# EAGLE design flex10k_board (EAGLE 8.2.2)
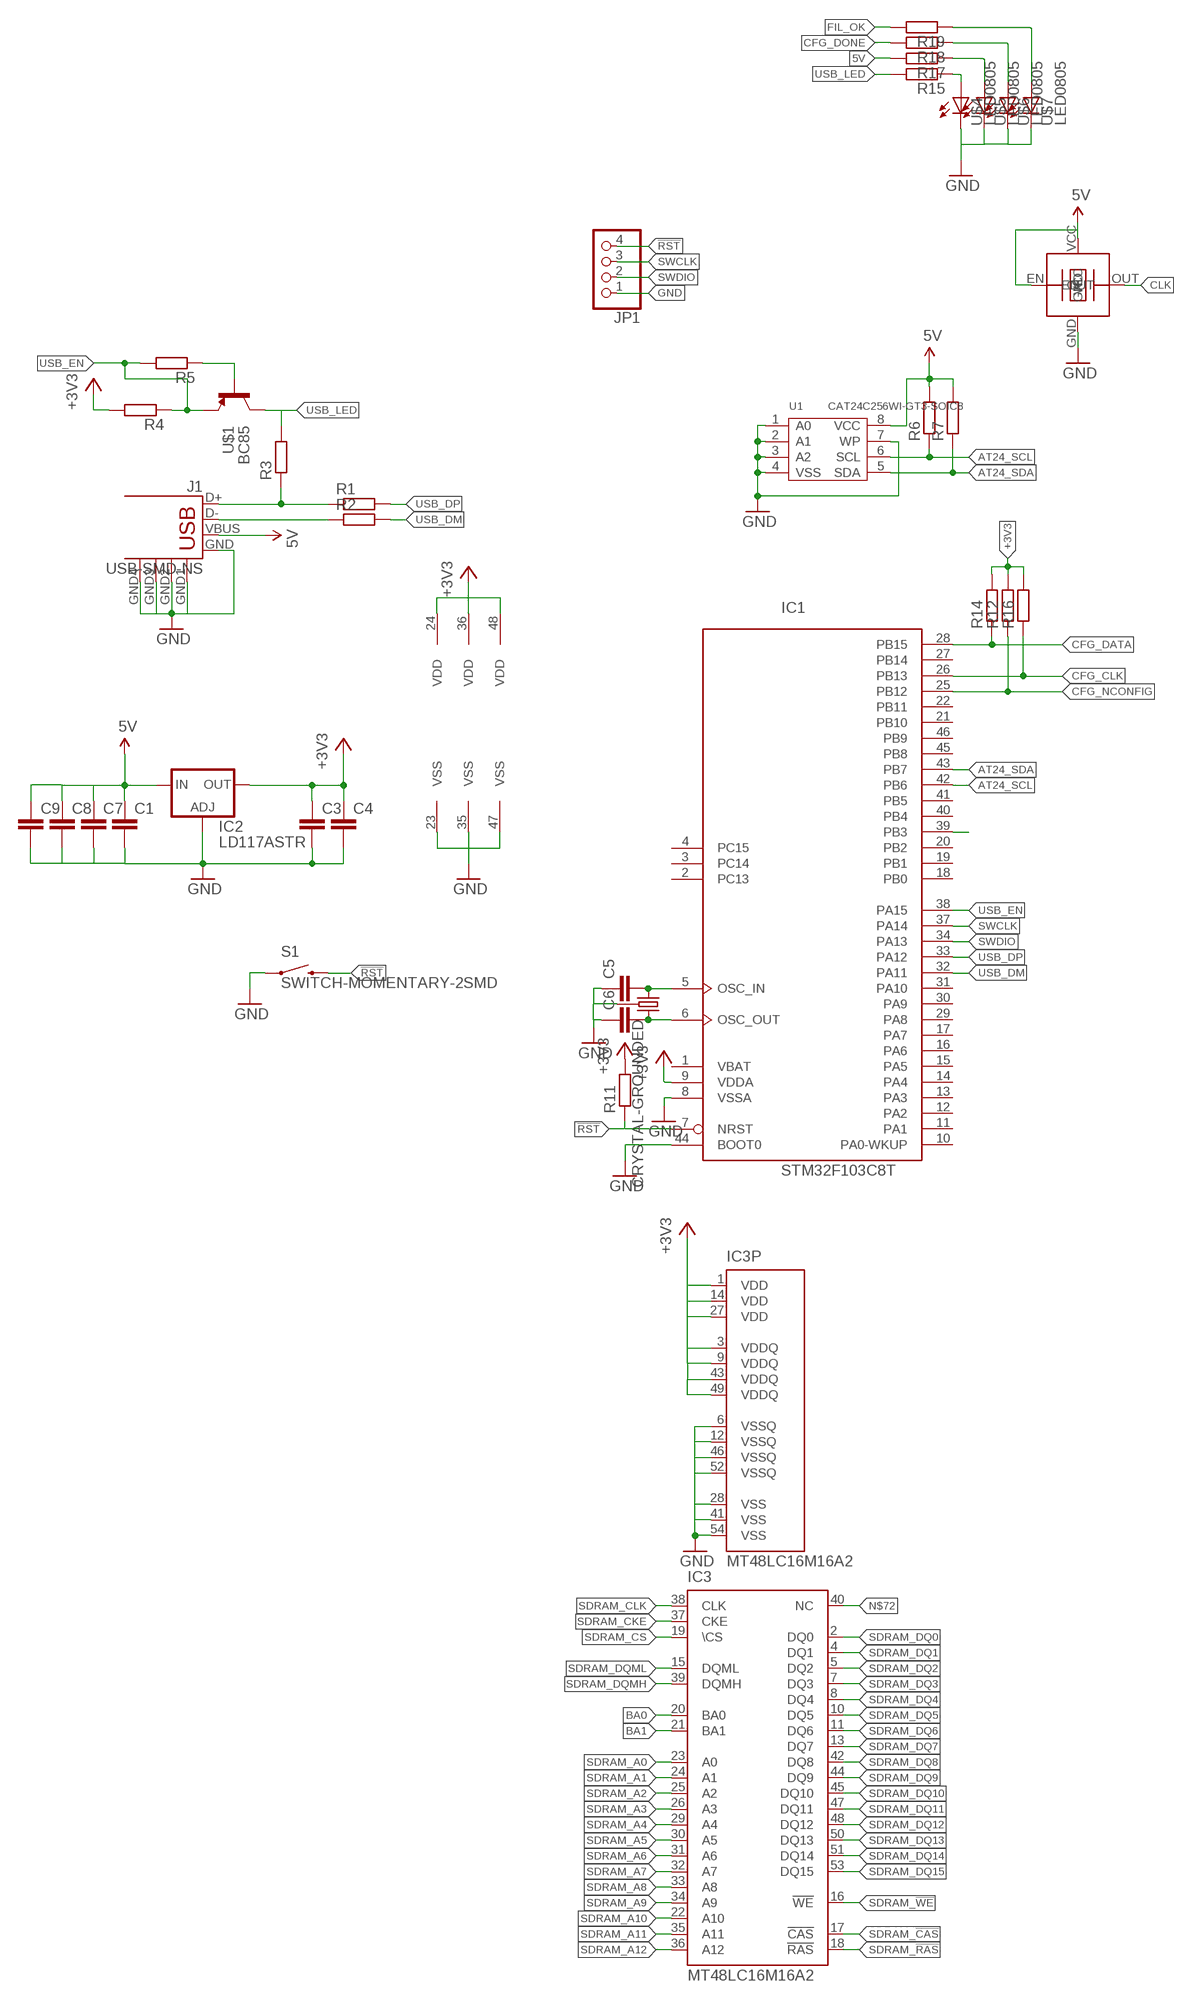
[diagram p0: schematic, sheet 1, part 1 of 3]
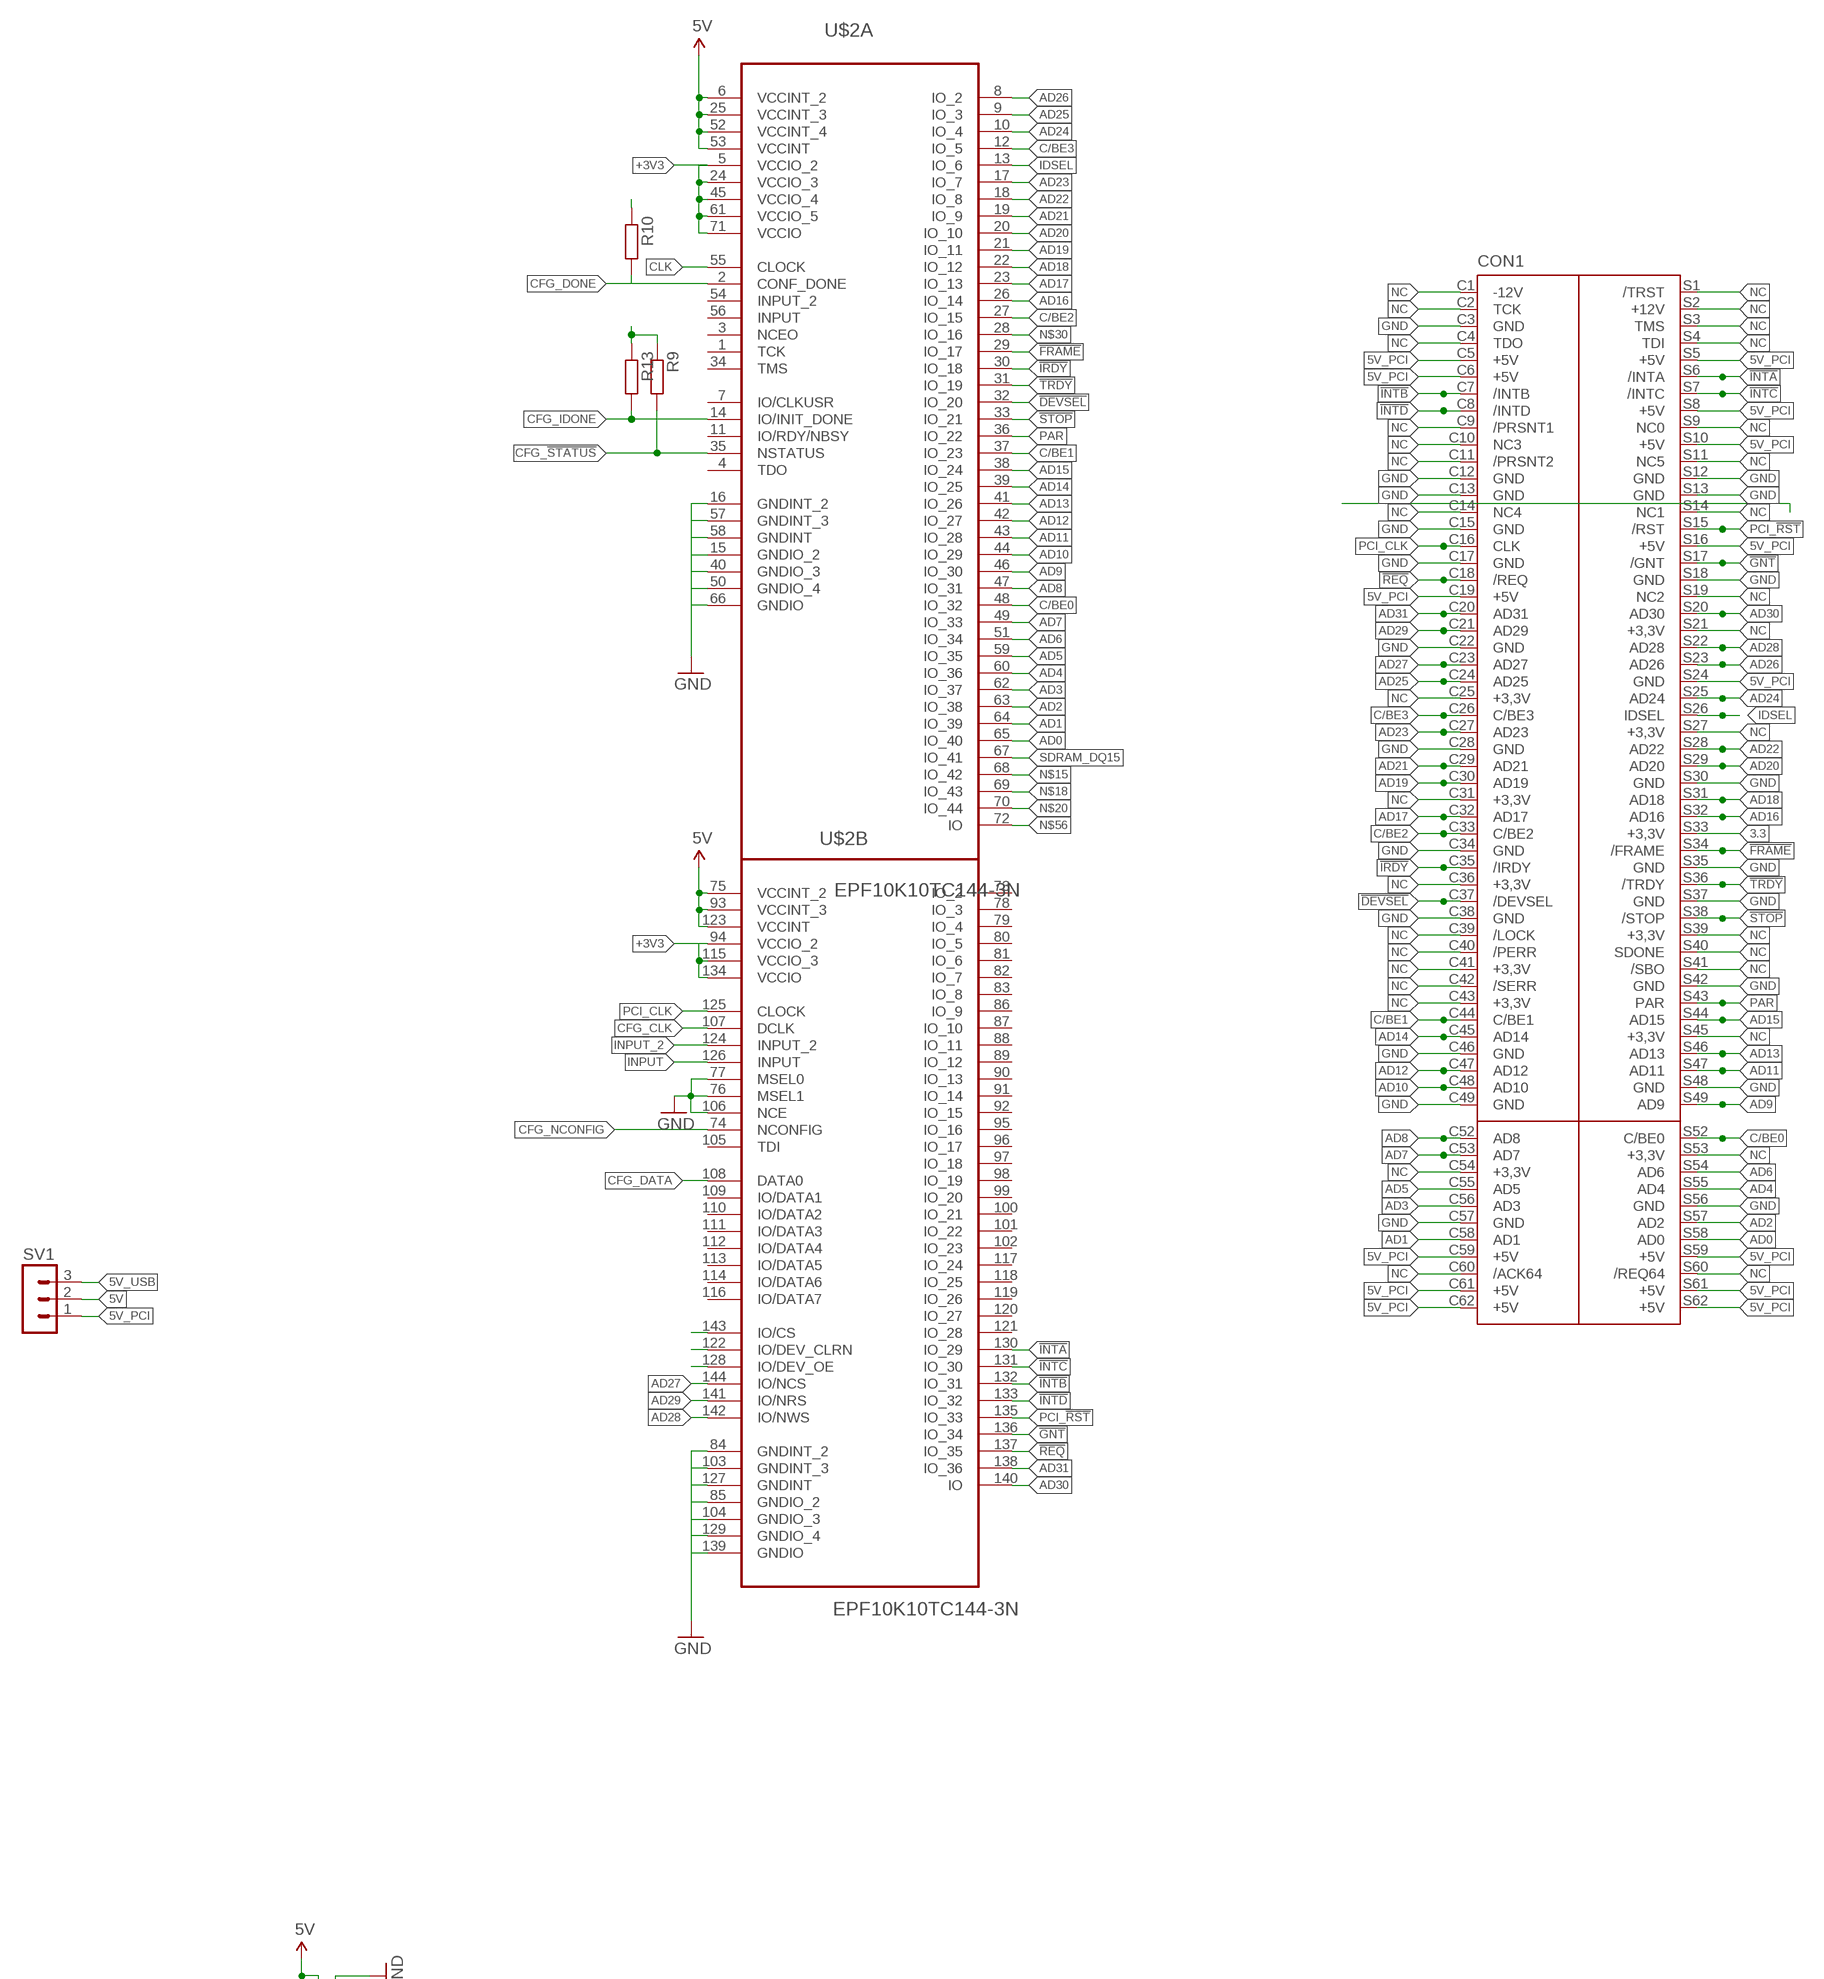
[diagram p1: schematic, sheet 1, part 2 of 3]
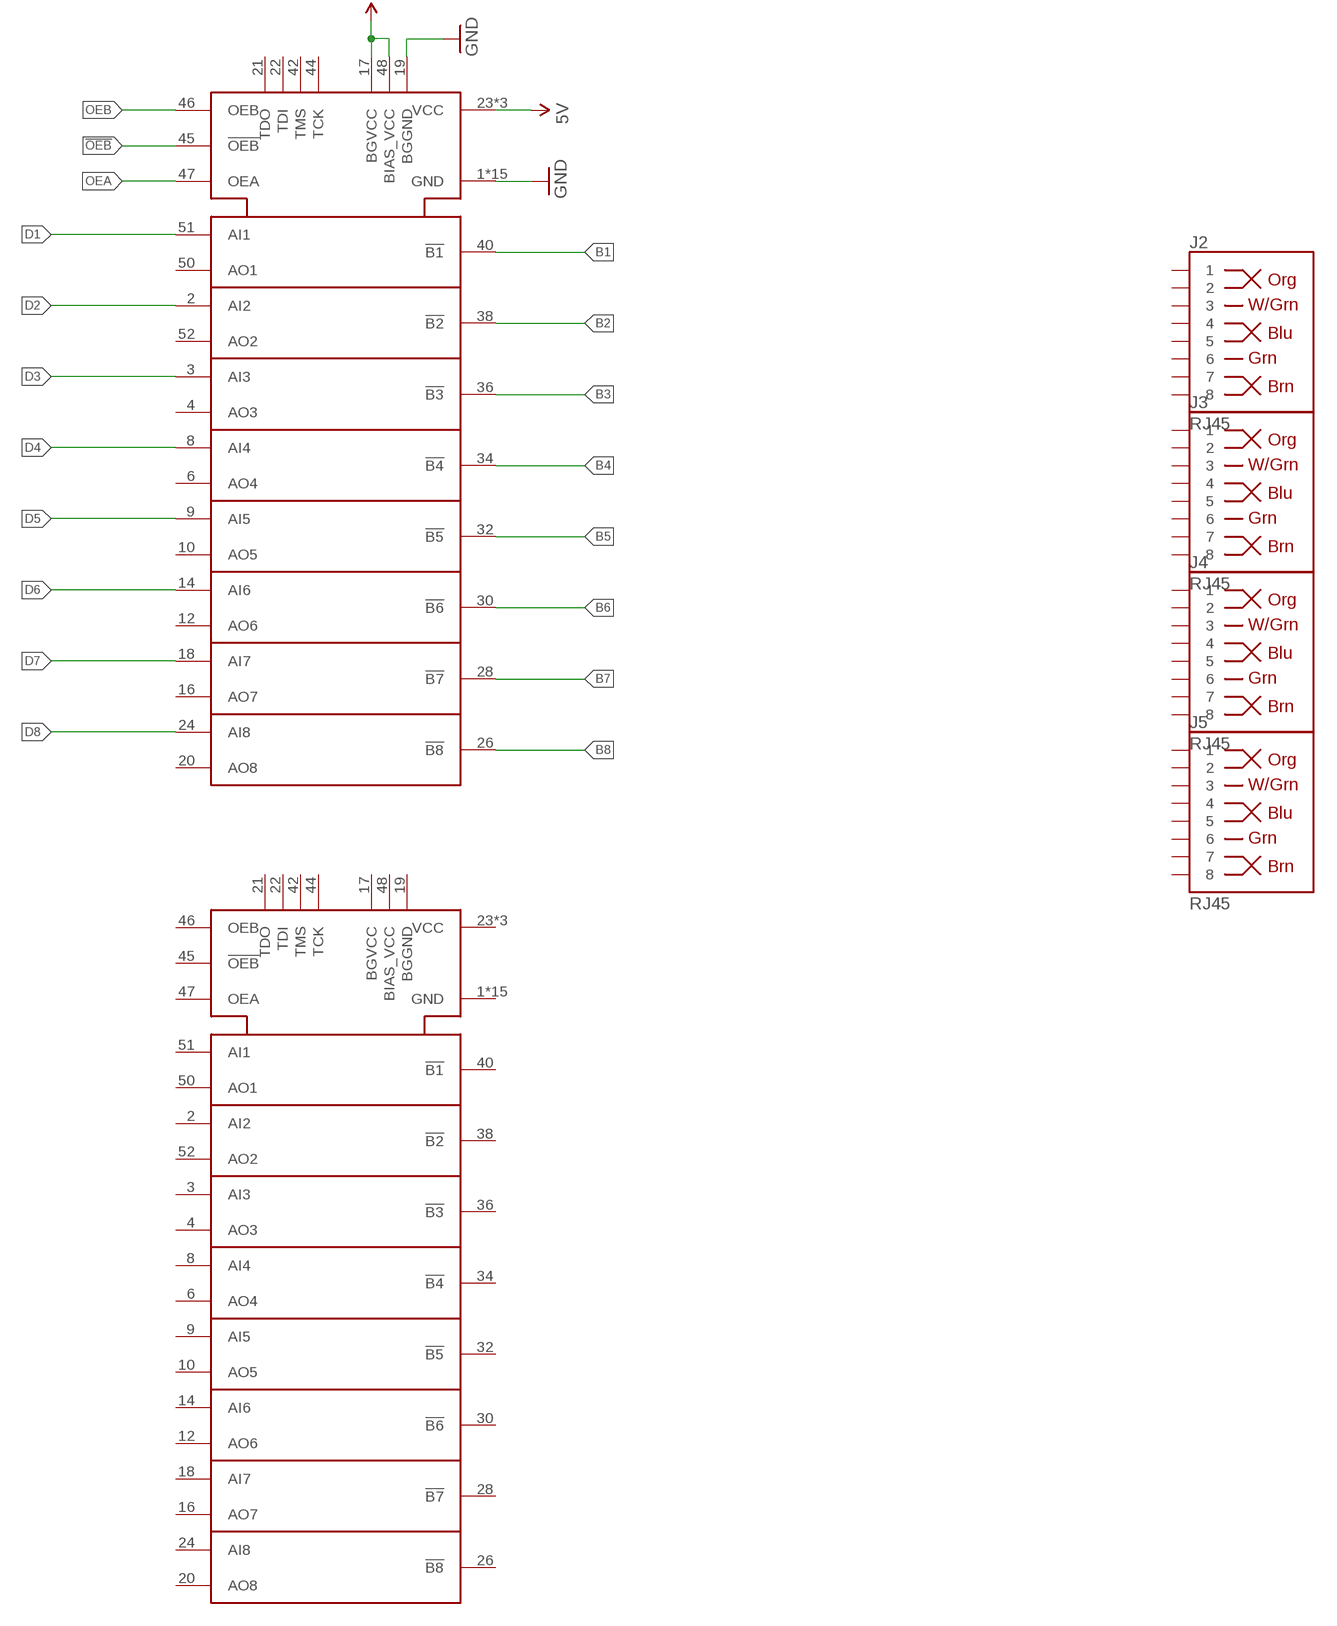
[diagram p2: schematic, sheet 1, part 3 of 3]

## Parts
C1  CC0805  [C0805]
C3  CC0805  [C0805]
C4  CC0805  [C0805]
C5  CC0603  [C0603]
C6  CC0603  [C0603]
C7  CC0805  [C0805]
C8  CC0805  [C0805]
C9  CC0805  [C0805]
CON1  PCI_CON  [PCI_BRDL]
IC1  STM32F103C8T  [LQFP48]
IC2  LD117ASTR  [SOT223]
IC3  MT48LC16M16A2  [TSOP54-400]
J1  USB-SMD-NS  [USB-MINIB-NOSTOP]
J2  RJ45  RJ45-8PTH  [RJ45-8]
J3  RJ45  RJ45-8PTH  [RJ45-8]
J4  RJ45  RJ45-8PTH  [RJ45-8]
J5  RJ45  RJ45-8PTH  [RJ45-8]
JP1  PINHD-1X4  [1X04]
R1  R0603  [0603]
R2  R0603  [0603]
R3  R0603  [0603]
R4  R0603  [0603]
R5  R0603  [0603]
R6  R0603  [0603]
R7  R0603  [0603]
R9  R0603  [0603]
R10  R0603  [0603]
R11  R0603  [0603]
R12  R0603  [0603]
R13  R0603  [0603]
R14  R0603  [0603]
R15  R0603  [0603]
R16  R0603  [0603]
R17  R0603  [0603]
R18  R0603  [0603]
R19  R0603  [0603]
S1  SWITCH-MOMENTARY-2SMD  [TACTILE-SWITCH-SMD]
SV1  MA03-1  [MA03-1]
U1  CAT24C256WI-GT3-SOIC8  EEPROM-CAT24C256WI-GT3(SOIC8)  [SOIC8-1.27-5X4MM]
U$1  BC85  [SOT23]
U$2  EPF10K10TC144-3N  [QFP50P2200X2200X160-144N]
U$3  TXC-BA  [7X5]
U$4  LED0805  [0805-LED]
U$5  LED0805  [0805-LED]
U$6  LED0805  [0805-LED]
U$7  LED0805  [0805-LED]
U$8  CRYSTAL-GROUNDED  [CRYSTAL-SMD-5X3]
U$9  SN74FB2050  [TQFP-10X10-52]
U$10  SN74FB2050  [TQFP-10X10-52]

## Nets
3.3: CON1.S33(+3,3V)
5V: C1.1 C7.1 C8.1 C9.1 IC2.3(IN) R6.2 R7.2 R17.2 SV1.2 U1.8(VCC) U$2.6(A:VCCINT_2) U$2.25(A:VCCINT_3) U$2.52(A:VCCINT_4) U$2.53(A:VCCINT) U$2.75(B:VCCINT_2) U$2.93(B:VCCINT_3) U$2.123(B:VCCINT) U$3.EN U$3.VCC U$10.17(BGVCC) U$10.23(VCC) U$10.43(VCC) U$10.48(BIAS_VCC) U$10.49(VCC)
5V_PCI: CON1.C5(+5V) CON1.C6(+5V) CON1.C19(+5V) CON1.C59(+5V) CON1.C61(+5V) CON1.C62(+5V) CON1.S5(+5V) CON1.S8(+5V) CON1.S10(+5V) CON1.S16(+5V) CON1.S24(GND) CON1.S59(+5V) CON1.S61(+5V) CON1.S62(+5V) SV1.1
5V_USB: J1.VBUS SV1.3 ; supply symbol labelled 5V
!DEVSEL: CON1.C37(/DEVSEL) U$2.32(A:IO_20)
!FRAME: CON1.S34(/FRAME) U$2.29(A:IO_17)
!GNT: CON1.S17(/GNT) U$2.136(B:IO_34)
!INTA: CON1.S6(/INTA) U$2.130(B:IO_29)
!INTB: CON1.C7(/INTB) U$2.132(B:IO_31)
!INTC: CON1.S7(/INTC) U$2.131(B:IO_30)
!INTD: CON1.C8(/INTD) U$2.133(B:IO_32)
!IRDY: CON1.C35(/IRDY) U$2.30(A:IO_18)
!OEB: U$10.45(!OEB)
!REQ: CON1.C18(/REQ) U$2.137(B:IO_35)
!RST: IC1.7(NRST) JP1.4 R11.1 S1.3
!STOP: CON1.S38(/STOP) U$2.33(A:IO_21)
!TRDY: CON1.S36(/TRDY) U$2.31(A:IO_19)
+3V3: C3.1 C4.1 IC1.9(VDDA) IC1.24(VDD) IC1.36(VDD) IC1.48(VDD) IC2.4(OUT) IC3.1(VDD) IC3.3(VDDQ) IC3.9(VDDQ) IC3.14(VDD) IC3.27(VDD) IC3.43(VDDQ) IC3.49(VDDQ) R4.2 R9.1 R10.1 R11.2 R12.2 R13.1 R14.2 R16.2 U$2.5(A:VCCIO_2) U$2.24(A:VCCIO_3) U$2.45(A:VCCIO_4) U$2.61(A:VCCIO_5) U$2.71(A:VCCIO) U$2.94(B:VCCIO_2) U$2.115(B:VCCIO_3) U$2.134(B:VCCIO)
AD0: CON1.S58(AD0) U$2.65(A:IO_40)
AD1: CON1.C58(AD1) U$2.64(A:IO_39)
AD2: CON1.S57(AD2) U$2.63(A:IO_38)
AD3: CON1.C56(AD3) U$2.62(A:IO_37)
AD4: CON1.S55(AD4) U$2.60(A:IO_36)
AD5: CON1.C55(AD5) U$2.59(A:IO_35)
AD6: CON1.S54(AD6) U$2.51(A:IO_34)
AD7: CON1.C53(AD7) U$2.49(A:IO_33)
AD8: CON1.C52(AD8) U$2.47(A:IO_31)
AD9: CON1.S49(AD9) U$2.46(A:IO_30)
AD10: CON1.C48(AD10) U$2.44(A:IO_29)
AD11: CON1.S47(AD11) U$2.43(A:IO_28)
AD12: CON1.C47(AD12) U$2.42(A:IO_27)
AD13: CON1.S46(AD13) U$2.41(A:IO_26)
AD14: CON1.C45(AD14) U$2.39(A:IO_25)
AD15: CON1.S44(AD15) U$2.38(A:IO_24)
AD16: CON1.S32(AD16) U$2.26(A:IO_14)
AD17: CON1.C32(AD17) U$2.23(A:IO_13)
AD18: CON1.S31(AD18) U$2.22(A:IO_12)
AD19: CON1.C30(AD19) U$2.21(A:IO_11)
AD20: CON1.S29(AD20) U$2.20(A:IO_10)
AD21: CON1.C29(AD21) U$2.19(A:IO_9)
AD22: CON1.S28(AD22) U$2.18(A:IO_8)
AD23: CON1.C27(AD23) U$2.17(A:IO_7)
AD24: CON1.S25(AD24) U$2.10(A:IO_4)
AD25: CON1.C24(AD25) U$2.9(A:IO_3)
AD26: CON1.S23(AD26) U$2.8(A:IO_2)
AD27: CON1.C23(AD27) U$2.144(B:IO/NCS)
AD28: CON1.S22(AD28) U$2.142(B:IO/NWS)
AD29: CON1.C21(AD29) U$2.141(B:IO/NRS)
AD30: CON1.S20(AD30) U$2.140(B:IO)
AD31: CON1.C20(AD31) U$2.138(B:IO_36)
AT24_SCL: IC1.42(PB6) R6.1 U1.6(SCL)
AT24_SDA: IC1.43(PB7) R7.1 U1.5(SDA)
B1: U$10.40(!B1)
B2: U$10.38(!B2)
B3: U$10.36(!B3)
B4: U$10.34(!B4)
B5: U$10.32(!B5)
B6: U$10.30(!B6)
B7: U$10.28(!B7)
B8: U$10.26(!B8)
BA0: IC3.20(BA0)
BA1: IC3.21(BA1)
C/BE0: CON1.S52(C/BE0) U$2.48(A:IO_32)
C/BE1: CON1.C44(C/BE1) U$2.37(A:IO_23)
C/BE2: CON1.C33(C/BE2) U$2.27(A:IO_15)
C/BE3: CON1.C26(C/BE3) U$2.12(A:IO_5)
CFG_!STATUS: R9.2 U$2.35(A:NSTATUS)
CFG_CLK: IC1.26(PB13) R16.1 U$2.107(B:DCLK)
CFG_DATA: IC1.28(PB15) R14.1 U$2.108(B:DATA0)
CFG_DONE: R10.2 R18.2 U$2.2(A:CONF_DONE)
CFG_IDONE: R13.2 U$2.14(A:IO/INIT_DONE)
CFG_NCONFIG: IC1.25(PB12) R12.1 U$2.74(B:NCONFIG)
CLK: U$2.55(A:CLOCK) U$3.OUT
D1: U$10.51(AI1)
D2: U$10.2(AI2)
D3: U$10.3(AI3)
D4: U$10.8(AI4)
D5: U$10.9(AI5)
D6: U$10.14(AI6)
D7: U$10.18(AI7)
D8: U$10.24(AI8)
FIL_OK: IC1.39(PB3) R19.2
GND: C1.2 C3.2 C4.2 C5.1 C6.1 C7.2 C8.2 C9.2 CON1.C3(GND) CON1.C12(GND) CON1.C13(GND) CON1.C15(GND) CON1.C17(GND) CON1.C22(GND) CON1.C28(GND) CON1.C34(GND) CON1.C38(GND) CON1.C46(GND) CON1.C49(GND) CON1.C57(GND) CON1.S12(GND) CON1.S13(GND) CON1.S18(GND) CON1.S30(GND) CON1.S35(GND) CON1.S37(GND) CON1.S42(GND) CON1.S48(GND) CON1.S56(GND) IC1.8(VSSA) IC1.23(VSS) IC1.35(VSS) IC1.44(BOOT0) IC1.47(VSS) IC2.1(ADJ) IC3.6(VSSQ) IC3.12(VSSQ) IC3.28(VSS) IC3.41(VSS) IC3.46(VSSQ) IC3.52(VSSQ) IC3.54(VSS) J1.GND J1.GND1(GND) J1.GND2(GND) J1.GND3(GND) J1.GND4(GND) JP1.1 S1.1 U1.1(A0) U1.2(A1) U1.3(A2) U1.4(VSS) U1.7(WP) U$2.15(A:GNDIO_2) U$2.16(A:GNDINT_2) U$2.40(A:GNDIO_3) U$2.50(A:GNDIO_4) U$2.57(A:GNDINT_3) U$2.58(A:GNDINT) U$2.66(A:GNDIO) U$2.76(B:MSEL1) U$2.77(B:MSEL0) U$2.84(B:GNDINT_2) U$2.85(B:GNDIO_2) U$2.103(B:GNDINT_3) U$2.104(B:GNDIO_3) U$2.106(B:NCE) U$2.127(B:GNDINT) U$2.129(B:GNDIO_4) U$2.139(B:GNDIO) U$3.GND U$4.C U$5.C U$6.C U$7.C U$8.2 U$8.4 U$10.1(GND) U$10.5(GND) U$10.7(GND) U$10.11(GND) U$10.13(GND) U$10.15(GND) U$10.19(BGGND) U$10.25(GND) U$10.27(GND) U$10.29(GND) U$10.31(GND) U$10.33(GND) U$10.35(GND) U$10.37(GND) U$10.39(GND) U$10.41(GND)
IDSEL: CON1.S26(IDSEL) U$2.13(A:IO_6)
INPUT: U$2.126(B:INPUT)
INPUT_2: U$2.124(B:INPUT_2)
N$1: C5.2 IC1.5(OSC_IN) U$8.3
N$2: J1.D- R2.1
N$3: C6.2 IC1.6(OSC_OUT) U$8.1
N$4: J1.D+ R1.1 R3.1
N$5: U$2.128(B:IO/DEV_OE)
N$6: U$2.122(B:IO/DEV_CLRN)
N$7: R5.1 U$1.1(B)
N$9: U$2.143(B:IO/CS)
N$10: R15.1 U$4.A
N$11: R17.1 U$5.A
N$12: R18.1 U$6.A
N$13: R19.1 U$7.A
N$15: U$2.68(A:IO_42)
N$18: U$2.69(A:IO_43)
N$20: U$2.70(A:IO_44)
N$30: U$2.28(A:IO_16)
N$56: U$2.72(A:IO)
N$72: IC3.40(NC)
NC: CON1.C1(-12V) CON1.C2(TCK) CON1.C4(TDO) CON1.C9(/PRSNT1) CON1.C10(NC3) CON1.C11(/PRSNT2) CON1.C14(NC4) CON1.C25(+3,3V) CON1.C31(+3,3V) CON1.C36(+3,3V) CON1.C39(/LOCK) CON1.C40(/PERR) CON1.C41(+3,3V) CON1.C42(/SERR) CON1.C43(+3,3V) CON1.C54(+3,3V) CON1.C60(/ACK64) CON1.S1(/TRST) CON1.S2(+12V) CON1.S3(TMS) CON1.S4(TDI) CON1.S9(NC0) CON1.S11(NC5) CON1.S14(NC1) CON1.S19(NC2) CON1.S21(+3,3V) CON1.S27(+3,3V) CON1.S39(+3,3V) CON1.S40(SDONE) CON1.S41(/SBO) CON1.S45(+3,3V) CON1.S53(+3,3V) CON1.S60(/REQ64)
OEA: U$10.47(OEA)
OEB: U$10.46(OEB)
PAR: CON1.S43(PAR) U$2.36(A:IO_22)
PCI_!RST: CON1.S15(/RST) U$2.135(B:IO_33)
PCI_CLK: CON1.C16(CLK) U$2.125(B:CLOCK)
SDRAM_!CAS: IC3.17(!CAS)
SDRAM_!RAS: IC3.18(!RAS)
SDRAM_!WE: IC3.16(!WE)
SDRAM_A0: IC3.23(A0)
SDRAM_A1: IC3.24(A1)
SDRAM_A2: IC3.25(A2)
SDRAM_A3: IC3.26(A3)
SDRAM_A4: IC3.29(A4)
SDRAM_A5: IC3.30(A5)
SDRAM_A6: IC3.31(A6)
SDRAM_A7: IC3.32(A7)
SDRAM_A8: IC3.33(A8)
SDRAM_A9: IC3.34(A9)
SDRAM_A10: IC3.22(A10)
SDRAM_A11: IC3.35(A11)
SDRAM_A12: IC3.36(A12)
SDRAM_CKE: IC3.37(CKE)
SDRAM_CLK: IC3.38(CLK)
SDRAM_CS: IC3.19(\CS)
SDRAM_DQ0: IC3.2(DQ0)
SDRAM_DQ1: IC3.4(DQ1)
SDRAM_DQ2: IC3.5(DQ2)
SDRAM_DQ3: IC3.7(DQ3)
SDRAM_DQ4: IC3.8(DQ4)
SDRAM_DQ5: IC3.10(DQ5)
SDRAM_DQ6: IC3.11(DQ6)
SDRAM_DQ7: IC3.13(DQ7)
SDRAM_DQ8: IC3.42(DQ8)
SDRAM_DQ9: IC3.44(DQ9)
SDRAM_DQ10: IC3.45(DQ10)
SDRAM_DQ11: IC3.47(DQ11)
SDRAM_DQ12: IC3.48(DQ12)
SDRAM_DQ13: IC3.50(DQ13)
SDRAM_DQ14: IC3.51(DQ14)
SDRAM_DQ15: IC3.53(DQ15) U$2.67(A:IO_41)
SDRAM_DQMH: IC3.39(DQMH)
SDRAM_DQML: IC3.15(DQML)
SWCLK: IC1.37(PA14) JP1.3
SWDIO: IC1.34(PA13) JP1.2
USB_DM: IC1.32(PA11) R2.2
USB_DP: IC1.33(PA12) R1.2
USB_EN: IC1.38(PA15) R4.1 R5.2 U$1.2(E)
USB_LED: R3.2 R15.2 U$1.3(C)
Unconnected: IC1.2(PC13) IC1.3(PC14) IC1.4(PC15) IC1.10(PA0-WKUP) IC1.11(PA1) IC1.12(PA2) IC1.13(PA3) IC1.14(PA4) IC1.15(PA5) IC1.16(PA6) IC1.17(PA7) IC1.18(PB0) IC1.19(PB1) IC1.20(PB2) IC1.21(PB10) IC1.22(PB11) IC1.27(PB14) IC1.29(PA8) IC1.30(PA9) IC1.31(PA10) IC1.40(PB4) IC1.41(PB5) IC1.45(PB8) IC1.46(PB9) J2.1 J2.2 J2.3 J2.4 J2.5 J2.6 J2.7 J2.8 J3.1 J3.2 J3.3 J3.4 J3.5 J3.6 J3.7 J3.8 J4.1 J4.2 J4.3 J4.4 J4.5 J4.6 J4.7 J4.8 J5.1 J5.2 J5.3 J5.4 J5.5 J5.6 J5.7 J5.8 U$2.1(A:TCK) U$2.3(A:NCEO) U$2.4(A:TDO) U$2.7(A:IO/CLKUSR) U$2.11(A:IO/RDY/NBSY) U$2.34(A:TMS) U$2.54(A:INPUT_2) U$2.56(A:INPUT) U$2.73(B:IO_2) U$2.78(B:IO_3) U$2.79(B:IO_4) U$2.80(B:IO_5) U$2.81(B:IO_6) U$2.82(B:IO_7) U$2.83(B:IO_8) U$2.86(B:IO_9) U$2.87(B:IO_10) U$2.88(B:IO_11) U$2.89(B:IO_12) U$2.90(B:IO_13) U$2.91(B:IO_14) U$2.92(B:IO_15) U$2.95(B:IO_16) U$2.96(B:IO_17) U$2.97(B:IO_18) U$2.98(B:IO_19) U$2.99(B:IO_20) U$2.100(B:IO_21) U$2.101(B:IO_22) U$2.102(B:IO_23) U$2.105(B:TDI) U$2.109(B:IO/DATA1) U$2.110(B:IO/DATA2) U$2.111(B:IO/DATA3) U$2.112(B:IO/DATA4) U$2.113(B:IO/DATA5) U$2.114(B:IO/DATA6) U$2.116(B:IO/DATA7) U$2.117(B:IO_24) U$2.118(B:IO_25) U$2.119(B:IO_26) U$2.120(B:IO_27) U$2.121(B:IO_28) U$9.1(GND) U$9.2(AI2) U$9.3(AI3) U$9.4(AO3) U$9.5(GND) U$9.6(AO4) U$9.7(GND) U$9.8(AI4) U$9.9(AI5) U$9.10(AO5) U$9.11(GND) U$9.12(AO6) U$9.13(GND) U$9.14(AI6) U$9.15(GND) U$9.16(AO7) U$9.17(BGVCC) U$9.18(AI7) U$9.19(BGGND) U$9.20(AO8) U$9.21(TDO) U$9.22(TDI) U$9.23(VCC) U$9.24(AI8) U$9.25(GND) U$9.26(!B8) U$9.27(GND) U$9.28(!B7) U$9.29(GND) U$9.30(!B6) U$9.31(GND) U$9.32(!B5) U$9.33(GND) U$9.34(!B4) U$9.35(GND) U$9.36(!B3) U$9.37(GND) U$9.38(!B2) U$9.39(GND) U$9.40(!B1) U$9.41(GND) U$9.42(TMS) U$9.43(VCC) U$9.44(TCK) U$9.45(!OEB) U$9.46(OEB) U$9.47(OEA) U$9.48(BIAS_VCC) U$9.49(VCC) U$9.50(AO1) U$9.51(AI1) U$9.52(AO2) U$10.4(AO3) U$10.6(AO4) U$10.10(AO5) U$10.12(AO6) U$10.16(AO7) U$10.20(AO8) U$10.21(TDO) U$10.22(TDI) U$10.42(TMS) U$10.44(TCK) U$10.50(AO1) U$10.52(AO2)

## Power pins joined to a net without a drawn wire
VBAT: IC1.1(VBAT)

## Library data of the parts
C1 C3-C9 = smalsmd:C: Capacitor
CON1 = con-pc:PCI_CON: PCI BOARD LONG
IC1 = stm32:STM32F103C*T: ARM 32-bit Cortex™-M3 CPU 72 MHz maximum frequency 16 to 128 Kbytes of Flash memory 6 to 20 kbytes of SRAM 37 GPIOs 2.0 to 3.6 V application supply
IC2 = v-reg:LD117A?*: Low drop fixed and adjustable positive voltage regulators 1 A Source: http://www.st.com/stonline/products/literature/ds/7194/ld1117axx.pdf
IC3 = memory-micron:MT48LC16M16A2: 256Mb: x16 SDRAM MT48LC16M16A2 - 4 Meg x 16 x 4 banks Source: http://download.micron.com/pdf/datasheets/dram/sdram/256MSDRAM.pdf; OC_FARNELL: unknown; OC_NEWARK: unknown
J1 = SparkFun-Connectors:USB: USB Connectors USB-B-PTH is fully proven SKU : PRT-00139/CONN-08278 USB-miniB is fully proven SKU : PRT-00587 USB-A-PCB is untested. USB-A-H is throughly reviewed, but untested. Spark Fun Electronics SKU : PRT-00437 USB-B-SMT is throughly reviewed, but untested. Needs silkscreen touching up. USB-A-S has not been used/tested USB-MB-H has not been used/tested USB-MICROB has been used. CONN-09505
J2-J5 = SparkFun-Connectors:RJ45-8: RJ45 Jack Simple RJ45, 8-pin connection - connector for common Cat5, Cat5e, and Cat6 Ethernet cables. Footprint not yet proven in production. Connector sku is PRT-00643; Breakout PCB sku is BOB-00716.; PROD_ID: CONN-08506
JP1 = pinhead:PINHD-1X4: PIN HEADER
R1-R7 R9-R19 = smalsmd:R
S1 = SparkFun-Electromechanical:SWITCH-MOMENTARY-2: Various NO switches- pushbuttons, reed, etc; PROD_ID: SWCH-08247
SV1 = con-lstb:MA03-1: PIN HEADER; OC_FARNELL: unknown; OC_NEWARK: unknown
U1 = Seeed-OPL-ic:EEPROM-CAT24C256WI-GT3(SOIC8): 310090035; MPN: CAT24C256WI-GT3
U$1 = smalsmd:BC85*
U$2 = Altera_By_element14_Batch_1:EPF10K10TC144-3N: Embedded Programmable Logic Device; MPN: EPF10K10TC144-3N; OC_FARNELL: 1549377; OC_NEWARK: 51R8772; PACKAGE: QFP-144; SUPPLIER: Altera
U$3 = txc:TXC-BA**
U$4-U$7 = smalsmd:LED
U$8 = SparkFun-FreqCtrl:CRYSTAL-GROUNDED
U$9 U$10 = btl:SN74FB2050

## Board
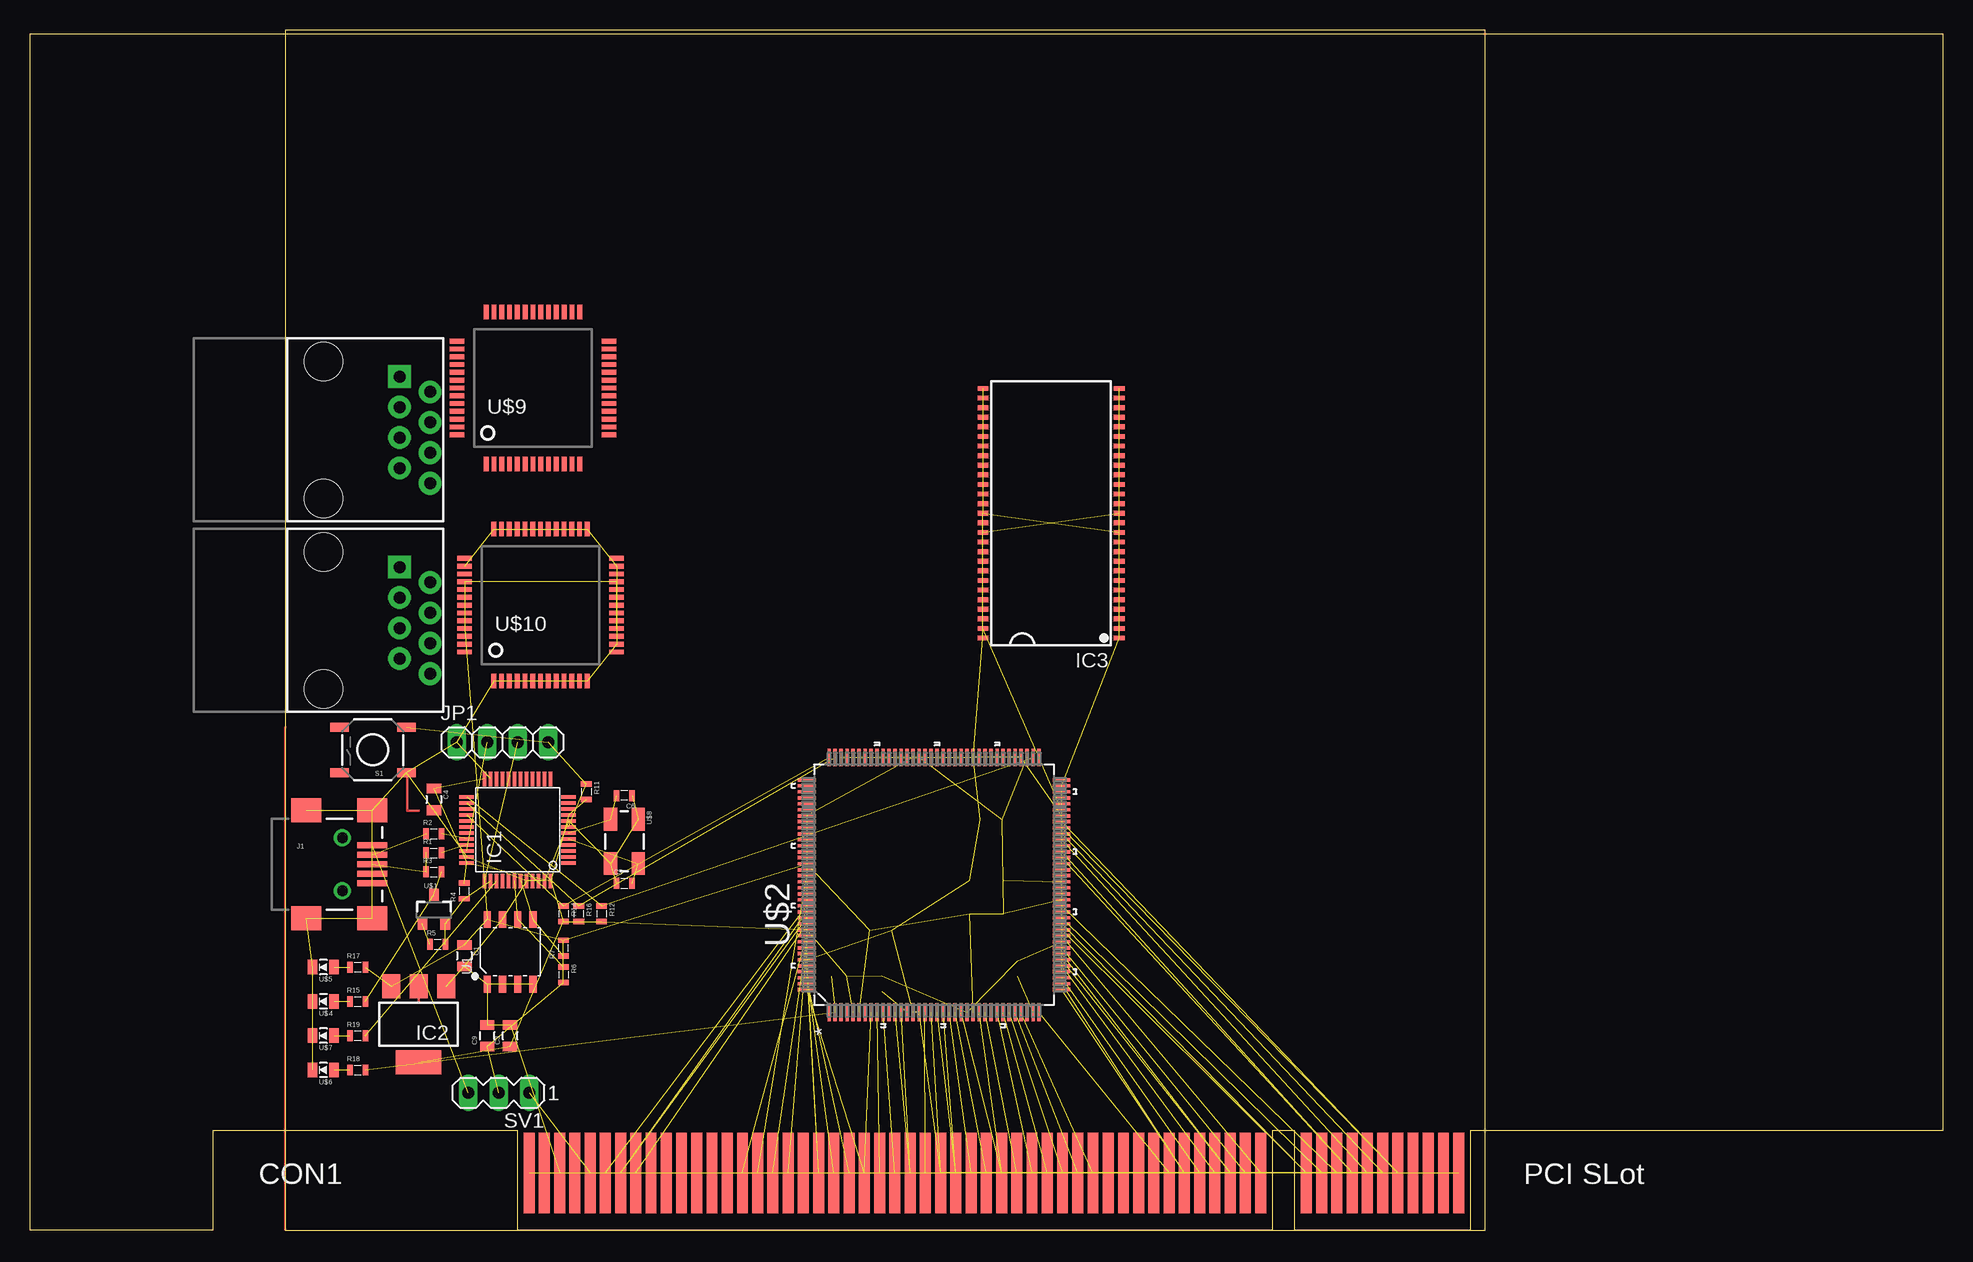
[diagram p3: board, top side]
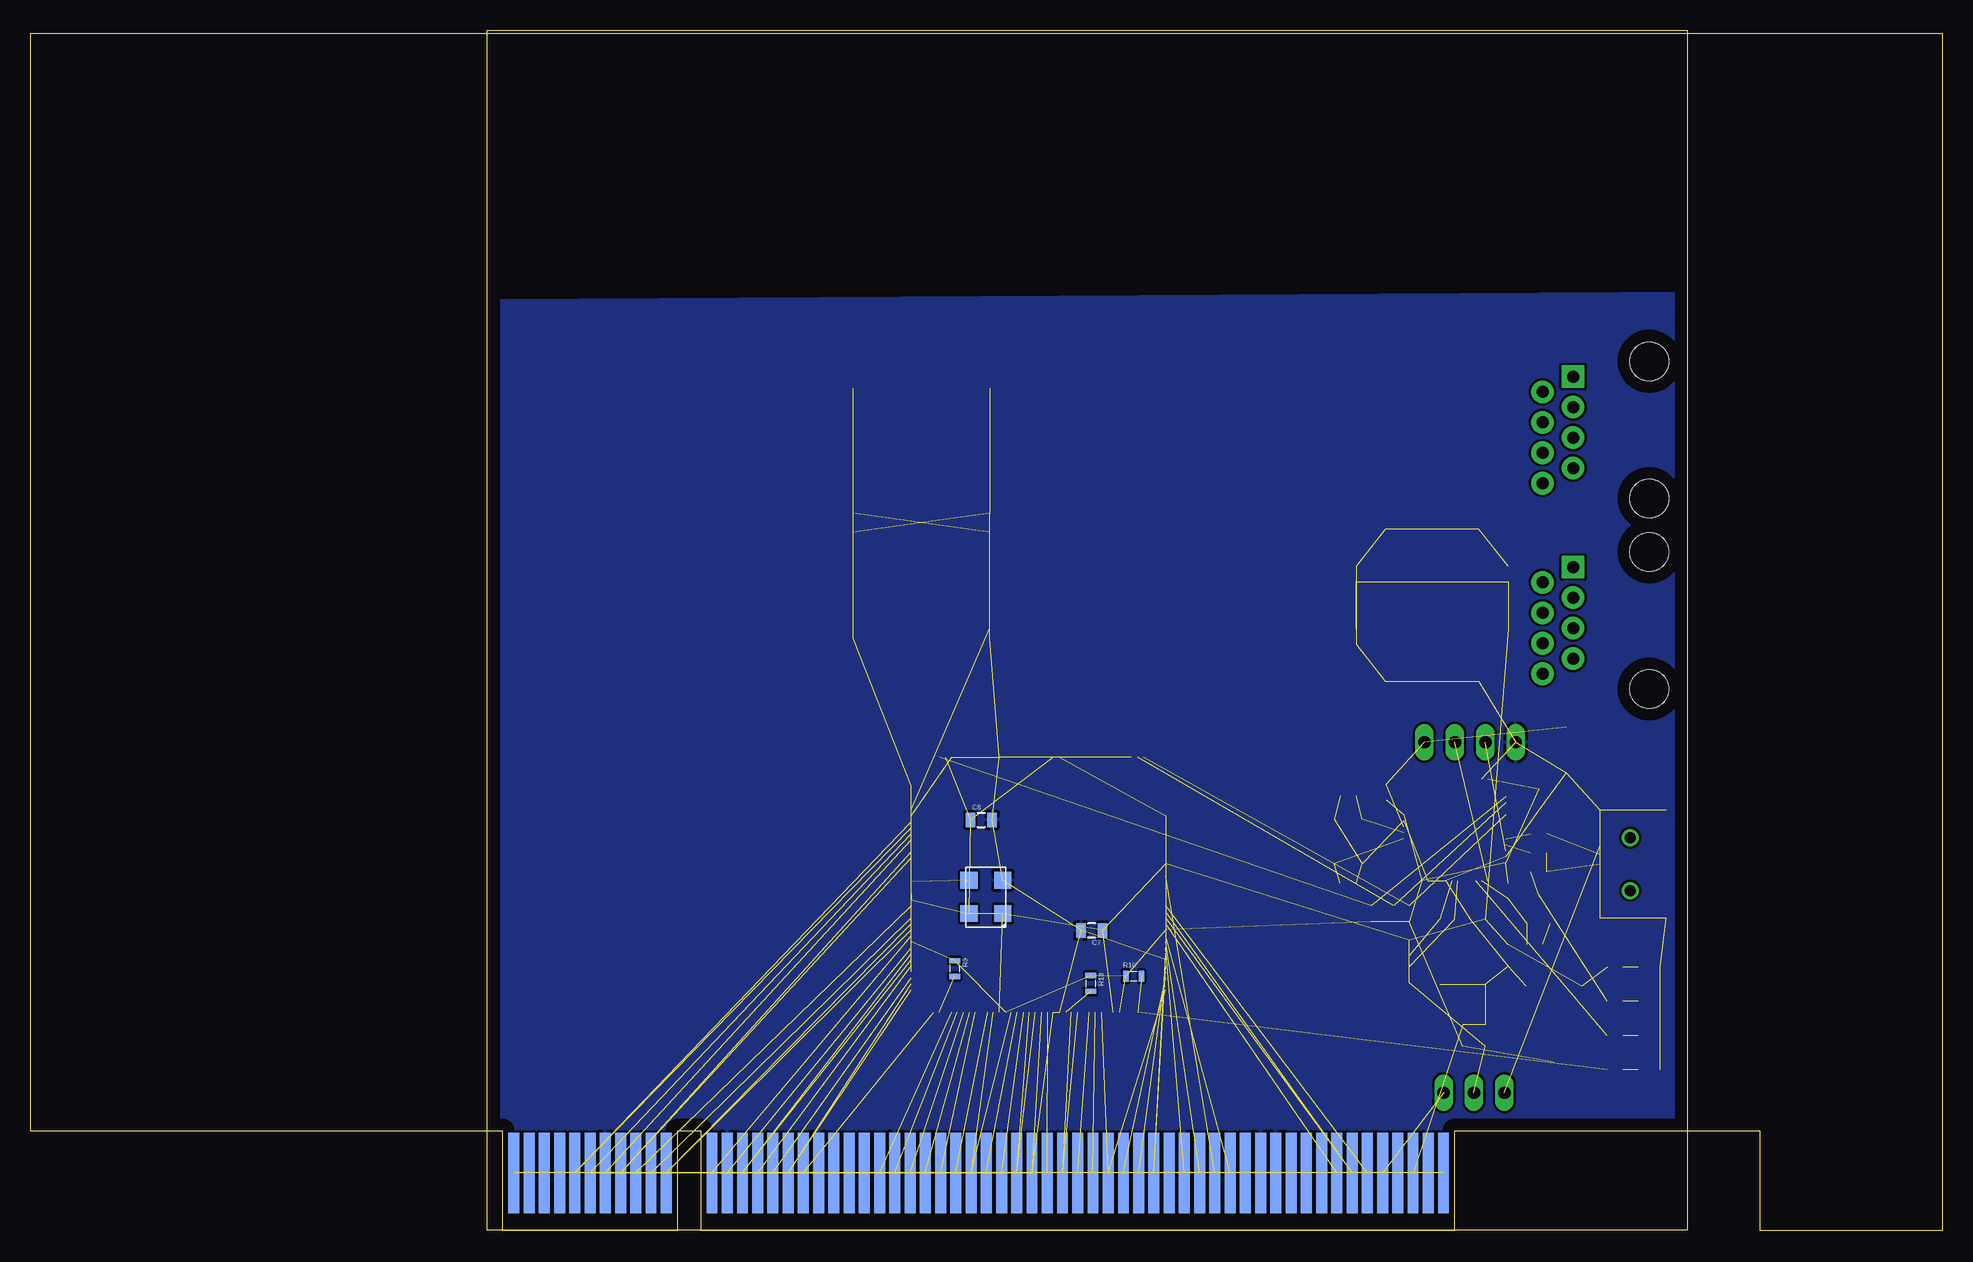
[diagram p4: board, bottom side, seen from below]

Size 100 x 100 mm. Coordinates in mm from the lower left corner, seen from the top.
Outline: 0,0 100,0 100,100 0,100 0,0
Copper layers (1*16): Top 0.035mm / dielectric 1.5mm / Bottom 0.035mm
Design rules "default *": minimum track width 0.2mm, minimum drill 0.3mm, track to track 0.15mm, track to pad 0.15mm, pad to pad 0.15mm, via to via 0.3mm, smd to smd 0.15mm, copper to edge 40mil, drill to drill 8mil, minimum pad ring 10mil, minimum via ring 8mil, stop-mask expansion 4mil, vias tented up to drill 0mil, thermal gap 10mil

### Footprints (pad centres in the part's own frame; a part is rotated, then mirrored left to right if it is on the bottom)
C0805 = smd 0.8 x 1.2: 1 -0.9,0; 2 0.9,0
C0603 = smd 0.45 x 0.9: 1 -0.65,0; 2 0.65,0
PCI_BRDL = smd 0.91 x 6.7: C1 41.593,4.763; C2 42.862,4.763; C3 44.133,4.763; C4 45.403,4.763; C5 46.672,4.763; C6 47.943,4.763; C7 49.212,4.763; C8 50.483,4.763; C9 51.752,4.763; C10 53.023,4.763; C11 54.292,4.763; C12 55.562,4.763; C13 56.833,4.763; C14 58.102,4.763; C15 59.373,4.763; C16 60.642,4.763; C17 61.913,4.763; C18 63.182,4.763; C19 64.453,4.763; C20 65.722,4.763; C21 66.993,4.763; C22 68.263,4.763; C23 69.532,4.763; C24 70.802,4.763; C25 72.073,4.763; C26 73.343,4.763; C27 74.612,4.763; C28 75.882,4.763; C29 77.153,4.763; C30 78.422,4.763; C31 79.692,4.763; C32 80.963,4.763; C33 82.233,4.763; C34 83.502,4.763; C35 84.772,4.763; C36 86.043,4.763; C37 87.312,4.763; C38 88.582,4.763; C39 89.853,4.763; C40 91.123,4.763; C41 92.392,4.763; C42 93.662,4.763; C43 94.933,4.763; C44 96.203,4.763; C45 97.472,4.763; C46 98.743,4.763; C47 100.013,4.763; C48 101.282,4.763; C49 102.552,4.763; C52 106.362,4.763; C53 107.632,4.763; C54 108.903,4.763; C55 110.172,4.763; C56 111.442,4.763; C57 112.713,4.763; C58 113.983,4.763; C59 115.252,4.763; C60 116.522,4.763; C61 117.793,4.763; C62 119.062,4.763 | smd 0.91 x 6.7 bottom: S1 41.593,4.763; S2 42.862,4.763; S3 44.133,4.763; S4 45.403,4.763; S5 46.672,4.763; S6 47.943,4.763; S7 49.212,4.763; S8 50.483,4.763; S9 51.752,4.763; S10 53.023,4.763; S11 54.292,4.763; S12 55.562,4.763; S13 56.833,4.763; S14 58.102,4.763; S15 59.373,4.763; S16 60.642,4.763; S17 61.913,4.763; S18 63.182,4.763; S19 64.453,4.763; S20 65.722,4.763; S21 66.993,4.763; S22 68.263,4.763; S23 69.532,4.763; S24 70.802,4.763; S25 72.073,4.763; S26 73.343,4.763; S27 74.612,4.763; S28 75.882,4.763; S29 77.153,4.763; S30 78.422,4.763; S31 79.692,4.763; S32 80.963,4.763; S33 82.233,4.763; S34 83.502,4.763; S35 84.772,4.763; S36 86.043,4.763; S37 87.312,4.763; S38 88.582,4.763; S39 89.853,4.763; S40 91.123,4.763; S41 92.392,4.763; S42 93.662,4.763; S43 94.933,4.763; S44 96.203,4.763; S45 97.472,4.763; S46 98.743,4.763; S47 100.013,4.763; S48 101.282,4.763; S49 102.552,4.763; S52 106.362,4.763; S53 107.632,4.763; S54 108.903,4.763; S55 110.172,4.763; S56 111.442,4.763; S57 112.713,4.763; S58 113.983,4.763; S59 115.252,4.763; S60 116.522,4.763; S61 117.793,4.763; S62 119.062,4.763
LQFP48 = smd 0.3 x 1.2: 1 -2.75,-4.25; 2 -2.25,-4.25; 3 -1.75,-4.25; 4 -1.25,-4.25; 5 -0.75,-4.25; 6 -0.25,-4.25; 7 0.25,-4.25; 8 0.75,-4.25; 9 1.25,-4.25; 10 1.75,-4.25; 11 2.25,-4.25; 12 2.75,-4.25; 25 2.75,4.25; 26 2.25,4.25; 27 1.75,4.25; 28 1.25,4.25; 29 0.75,4.25; 30 0.25,4.25; 31 -0.25,4.25; 32 -0.75,4.25; 33 -1.25,4.25; 34 -1.75,4.25; 35 -2.25,4.25; 36 -2.75,4.25 | smd 1.2 x 0.3: 13 4.25,-2.75; 14 4.25,-2.25; 15 4.25,-1.75; 16 4.25,-1.25; 17 4.25,-0.75; 18 4.25,-0.25; 19 4.25,0.25; 20 4.25,0.75; 21 4.25,1.25; 22 4.25,1.75; 23 4.25,2.25; 24 4.25,2.75; 37 -4.25,2.75; 38 -4.25,2.25; 39 -4.25,1.75; 40 -4.25,1.25; 41 -4.25,0.75; 42 -4.25,0.25; 43 -4.25,-0.25; 44 -4.25,-0.75; 45 -4.25,-1.25; 46 -4.25,-1.75; 47 -4.25,-2.25; 48 -4.25,-2.75
SOT223 = smd 1.5 x 2: 1 -2.3,-3.15; 2 0,-3.15; 3 2.3,-3.15 | smd 3.8 x 2: 4 0,3.15
TSOP54-400 = smd 0.4 x 0.9: 1 -10.4,-5.68; 2 -9.6,-5.68; 3 -8.8,-5.68; 4 -8,-5.68; 5 -7.2,-5.68; 6 -6.4,-5.68; 7 -5.6,-5.68; 8 -4.8,-5.68; 9 -4,-5.68; 10 -3.2,-5.68; 11 -2.4,-5.68; 12 -1.6,-5.68; 13 -0.8,-5.68; 14 0,-5.68; 15 0.8,-5.68; 16 1.6,-5.68; 17 2.4,-5.68; 18 3.2,-5.68; 19 4,-5.68; 20 4.8,-5.68; 21 5.6,-5.68; 22 6.4,-5.68; 23 7.2,-5.68; 24 8,-5.68; 25 8.8,-5.68; 26 9.6,-5.68; 27 10.4,-5.68; 28 10.4,5.68; 29 9.6,5.68; 30 8.8,5.68; 31 8,5.68; 32 7.2,5.68; 33 6.4,5.68; 34 5.6,5.68; 35 4.8,5.68; 36 4,5.68; 37 3.2,5.68; 38 2.4,5.68; 39 1.6,5.68; 40 0.8,5.68; 41 0,5.68; 42 -0.8,5.68; 43 -1.6,5.68; 44 -2.4,5.68; 45 -3.2,5.68; 46 -4,5.68; 47 -4.8,5.68; 48 -5.6,5.68; 49 -6.4,5.68; 50 -7.2,5.68; 51 -8,5.68; 52 -8.8,5.68; 53 -9.6,5.68; 54 -10.4,5.68
USB-MINIB-NOSTOP = smd 2.5 x 0.5: D+ 2.5,0; D- 2.5,0.8; GND 2.5,-1.6; ID 2.5,-0.8; VBUS 2.5,1.6 | smd 2.5 x 2: GND1 -3,4.5; GND2 2.5,4.5; GND3 2.5,-4.5; GND4 -3,-4.5 | drill 0.9 pad 0.8: H1 0,2.2 | drill 0.9 pad 0.787: H2 0,-2.2
RJ45-8 = drill 1 pad 1.88 square: 1 -4.445,6.35 | drill 1 pad 1.88: 2 -3.175,8.89; 3 -1.905,6.35; 4 -0.635,8.89; 5 0.635,6.35; 6 1.905,8.89; 7 3.175,6.35; 8 4.445,8.89 | hole 3.2: -5.715,0; 5.715,0
1X04 = drill 1.016 long: 1 -3.81,0; 2 -1.27,0; 3 1.27,0; 4 3.81,0
0603 = smd 0.45 x 0.9: 1 -0.65,0; 2 0.65,0
TACTILE-SWITCH-SMD = smd 1.524 x 0.762: 1 -2.794,1.905; 2 2.794,1.905; 3 -2.794,-1.905; 4 2.794,-1.905
MA03-1 = drill 1.016 long: 1 -2.54,0; 2 0,0; 3 2.54,0
SOIC8-1.27-5X4MM = smd 0.6 x 1.4: 1 -1.905,-2.7; 2 -0.635,-2.7; 3 0.635,-2.7; 4 1.905,-2.7; 5 1.905,2.7; 6 0.635,2.7; 7 -0.635,2.7; 8 -1.905,2.7
SOT23 = smd 0.8 x 1: 1 -0.95,-1.159; 2 0.95,-1.159; 3 0,1.259
QFP50P2200X2200X160-144N = smd 1.473 x 0.279: 1 -10.617,8.738; 2 -10.617,8.255; 3 -10.617,7.747; 4 -10.617,7.239; 5 -10.617,6.756; 6 -10.617,6.248; 7 -10.617,5.74; 8 -10.617,5.258; 9 -10.617,4.75; 10 -10.617,4.242; 11 -10.617,3.759; 12 -10.617,3.251; 13 -10.617,2.743; 14 -10.617,2.261; 15 -10.617,1.753; 16 -10.617,1.245; 17 -10.617,0.762; 18 -10.617,0.254; 19 -10.617,-0.254; 20 -10.617,-0.762; 21 -10.617,-1.245; 22 -10.617,-1.753; 23 -10.617,-2.261; 24 -10.617,-2.743; 25 -10.617,-3.251; 26 -10.617,-3.759; 27 -10.617,-4.242; 28 -10.617,-4.75; 29 -10.617,-5.258; 30 -10.617,-5.74; 31 -10.617,-6.248; 32 -10.617,-6.756; 33 -10.617,-7.239; 34 -10.617,-7.747; 35 -10.617,-8.255; 36 -10.617,-8.738; 73 10.617,-8.738; 74 10.617,-8.255; 75 10.617,-7.747; 76 10.617,-7.239; 77 10.617,-6.756; 78 10.617,-6.248; 79 10.617,-5.74; 80 10.617,-5.258; 81 10.617,-4.75; 82 10.617,-4.242; 83 10.617,-3.759; 84 10.617,-3.251; 85 10.617,-2.743; 86 10.617,-2.261; 87 10.617,-1.753; 88 10.617,-1.245; 89 10.617,-0.762; 90 10.617,-0.254; 91 10.617,0.254; 92 10.617,0.762; 93 10.617,1.245; 94 10.617,1.753; 95 10.617,2.261; 96 10.617,2.743; 97 10.617,3.251; 98 10.617,3.759; 99 10.617,4.242; 100 10.617,4.75; 101 10.617,5.258; 102 10.617,5.74; 103 10.617,6.248; 104 10.617,6.756; 105 10.617,7.239; 106 10.617,7.747; 107 10.617,8.255; 108 10.617,8.738 | smd 0.279 x 1.473: 37 -8.738,-10.617; 38 -8.255,-10.617; 39 -7.747,-10.617; 40 -7.239,-10.617; 41 -6.756,-10.617; 42 -6.248,-10.617; 43 -5.74,-10.617; 44 -5.258,-10.617; 45 -4.75,-10.617; 46 -4.242,-10.617; 47 -3.759,-10.617; 48 -3.251,-10.617; 49 -2.743,-10.617; 50 -2.261,-10.617; 51 -1.753,-10.617; 52 -1.245,-10.617; 53 -0.762,-10.617; 54 -0.254,-10.617; 55 0.254,-10.617; 56 0.762,-10.617; 57 1.245,-10.617; 58 1.753,-10.617; 59 2.261,-10.617; 60 2.743,-10.617; 61 3.251,-10.617; 62 3.759,-10.617; 63 4.242,-10.617; 64 4.75,-10.617; 65 5.258,-10.617; 66 5.74,-10.617; 67 6.248,-10.617; 68 6.756,-10.617; 69 7.239,-10.617; 70 7.747,-10.617; 71 8.255,-10.617; 72 8.738,-10.617; 109 8.738,10.617; 110 8.255,10.617; 111 7.747,10.617; 112 7.239,10.617; 113 6.756,10.617; 114 6.248,10.617; 115 5.74,10.617; 116 5.258,10.617; 117 4.75,10.617; 118 4.242,10.617; 119 3.759,10.617; 120 3.251,10.617; 121 2.743,10.617; 122 2.261,10.617; 123 1.753,10.617; 124 1.245,10.617; 125 0.762,10.617; 126 0.254,10.617; 127 -0.254,10.617; 128 -0.762,10.617; 129 -1.245,10.617; 130 -1.753,10.617; 131 -2.261,10.617; 132 -2.743,10.617; 133 -3.251,10.617; 134 -3.759,10.617; 135 -4.242,10.617; 136 -4.75,10.617; 137 -5.258,10.617; 138 -5.74,10.617; 139 -6.248,10.617; 140 -6.756,10.617; 141 -7.239,10.617; 142 -7.747,10.617; 143 -8.255,10.617; 144 -8.738,10.617
7X5 = smd 1.4 x 1.45: EN -1.448,-1.465; GND 1.333,-1.465; OUT 1.333,1.345; VCC -1.448,1.345
0805-LED = smd 0.8 x 1.2: A -0.9,0; C 0.9,0
CRYSTAL-SMD-5X3 = smd 1.9 x 1.1: 1 -1.85,-1.15; 2 1.85,-1.15; 3 1.85,1.15; 4 -1.85,1.15
TQFP-10X10-52 = smd 0.4 x 1.2: 1 -3.9,-6.335; 2 -3.25,-6.335; 3 -2.6,-6.335; 4 -1.95,-6.335; 5 -1.3,-6.335; 6 -0.65,-6.335; 7 0,-6.335; 8 0.65,-6.335; 9 1.3,-6.335; 10 1.95,-6.335; 11 2.6,-6.335; 12 3.25,-6.335; 13 3.9,-6.335; 27 3.9,6.335; 28 3.25,6.335; 29 2.6,6.335; 30 1.95,6.335; 31 1.3,6.335; 32 0.65,6.335; 33 0,6.335; 34 -0.65,6.335; 35 -1.3,6.335; 36 -1.95,6.335; 37 -2.6,6.335; 38 -3.25,6.335; 39 -3.9,6.335 | smd 1.2 x 0.4: 14 6.335,-3.9; 15 6.335,-3.25; 16 6.335,-2.6; 17 6.335,-1.95; 18 6.335,-1.3; 19 6.335,-0.65; 20 6.335,0; 21 6.335,0.65; 22 6.335,1.3; 23 6.335,1.95; 24 6.335,2.6; 25 6.335,3.25; 26 6.335,3.9; 40 -6.335,3.9; 41 -6.335,3.25; 42 -6.335,2.6; 43 -6.335,1.95; 44 -6.335,1.3; 45 -6.335,0.65; 46 -6.335,0; 47 -6.335,-0.65; 48 -6.335,-1.3; 49 -6.335,-1.95; 50 -6.335,-2.6; 51 -6.335,-3.25; 52 -6.335,-3.9

### Placement (x,y rotation side)
C1  14.92,22.86 270 top
C3  18.73,16.19 90 top
C4  12.38,35.88 270 top
C5  28.26,28.89 0 top
C6  28.26,36.2 180 top
C7  49.63,24.96 180 bottom
C8  58.83,34.17 0 bottom
C9  16.83,16.19 90 top
CON1  -21.27,0 0 top
IC1  19.37,33.34 90 top
IC2  11.11,17.14 180 top
IC3  63.82,59.73 90 top
J1  4.76,30.48 0 top
J2  3.17,50.8 270 top
J3  3.17,66.67 270 top
J4  -92.08,9.21 0 top  (outside the outline)
J5  -120.02,9.21 0 top  (outside the outline)
JP1  18.1,40.64 0 top
R1  12.38,31.43 0 top
R2  12.38,33.02 0 top
R3  12.38,29.84 0 top
R4  14.92,28.26 90 top
R5  12.7,23.81 0 top
R6  23.18,21.27 270 top
R7  23.18,23.5 90 top
R9  61.06,21.78 270 bottom
R10  46.13,21.15 0 bottom
R11  25.08,36.51 270 top
R12  26.35,26.35 270 top
R13  49.72,20.54 270 bottom
R14  23.18,26.35 270 top
R15  6.03,19.05 0 top
R16  24.45,26.35 270 top
R17  6.03,21.91 0 top
R18  6.03,13.34 0 top
R19  6.03,16.19 0 top
S1  7.3,40 180 top
SV1  17.78,11.43 180 top
U1  18.73,23.18 0 top
U$1  12.38,26.67 0 top
U$2  54.07,28.77 90 top
U$3  TXC-BA*  [7X5]  58.52,27.82 90 bottom
U$4  3.17,19.05 180 top
U$5  3.17,21.91 180 top
U$6  3.17,13.34 180 top
U$7  3.17,16.19 180 top
U$8  28.26,32.38 270 top
U$9  20.64,70.17 0 top
U$10  21.27,52.07 0 top

### Tracks (layer width: path | path; a pad name or v marks a point on that pad's centre or on a via)
5V  (23 unrouted)
5V_PCI  (14 unrouted)
5V_USB  (1 unrouted)
!DEVSEL  (1 unrouted)
!FRAME  (1 unrouted)
!GNT  (1 unrouted)
!INTA  (1 unrouted)
!INTB  (1 unrouted)
!INTC  (1 unrouted)
!INTD  (1 unrouted)
!IRDY  (1 unrouted)
!REQ  (1 unrouted)
!RST  (3 unrouted)
!STOP  (1 unrouted)
!TRDY  (1 unrouted)
+3V3  (29 unrouted)
AD0  (1 unrouted)
AD1  (1 unrouted)
AD2  (1 unrouted)
AD3  (1 unrouted)
AD4  (1 unrouted)
AD5  (1 unrouted)
AD6  (1 unrouted)
AD7  (1 unrouted)
AD8  (1 unrouted)
AD9  (1 unrouted)
AD10  (1 unrouted)
AD11  (1 unrouted)
AD12  (1 unrouted)
AD13  (1 unrouted)
AD14  (1 unrouted)
AD15  (1 unrouted)
AD16  (1 unrouted)
AD17  (1 unrouted)
AD18  (1 unrouted)
AD19  (1 unrouted)
AD20  (1 unrouted)
AD21  (1 unrouted)
AD22  (1 unrouted)
AD23  (1 unrouted)
AD24  (1 unrouted)
AD25  (1 unrouted)
AD26  (1 unrouted)
AD27  (1 unrouted)
AD28  (1 unrouted)
AD29  (1 unrouted)
AD30  (1 unrouted)
AD31  (1 unrouted)
AT24_SCL  (2 unrouted)
AT24_SDA  (2 unrouted)
C/BE0  (1 unrouted)
C/BE1  (1 unrouted)
C/BE2  (1 unrouted)
C/BE3  (1 unrouted)
CFG_!STATUS  (1 unrouted)
CFG_CLK  (2 unrouted)
CFG_DATA  (2 unrouted)
CFG_DONE  (2 unrouted)
CFG_IDONE  (1 unrouted)
CFG_NCONFIG  (2 unrouted)
CLK  (1 unrouted)
FIL_OK  (1 unrouted)
GND  (93 unrouted)
  pour Bottom (isolate 0.2): -0.95,78.11 99.06,77.47 99.38,1.59 -4.13,1.59 -4.45,57.78
IDSEL  (1 unrouted)
N$1  (2 unrouted)
N$2  (1 unrouted)
N$3  (2 unrouted)
N$4  (2 unrouted)
N$7  (1 unrouted)
N$8
  Top 0.2: 37.78,6.03 37.78,5.08 38.1,5.08
N$10  (1 unrouted)
N$11  (1 unrouted)
N$12  (1 unrouted)
N$13  (1 unrouted)
N$14
  Top 0.2: 50.8,4.45 50.48,4.76
N$16
  Top 0.2: 11.11,19.05 11.11,20.32
N$17
  Top 0.2: 10.16,38.1 10.16,34.95 10.19,34.92 11.11,34.92
N$19
  Top 0.152: 0,0 0,41.91
NC  (32 unrouted)
PAR  (1 unrouted)
PCI_!RST  (1 unrouted)
PCI_CLK  (1 unrouted)
SDRAM_DQ15  (1 unrouted)
SWCLK  (1 unrouted)
SWDIO  (1 unrouted)
USB_DM  (1 unrouted)
USB_DP  (1 unrouted)
USB_EN  (3 unrouted)
USB_LED  (2 unrouted)